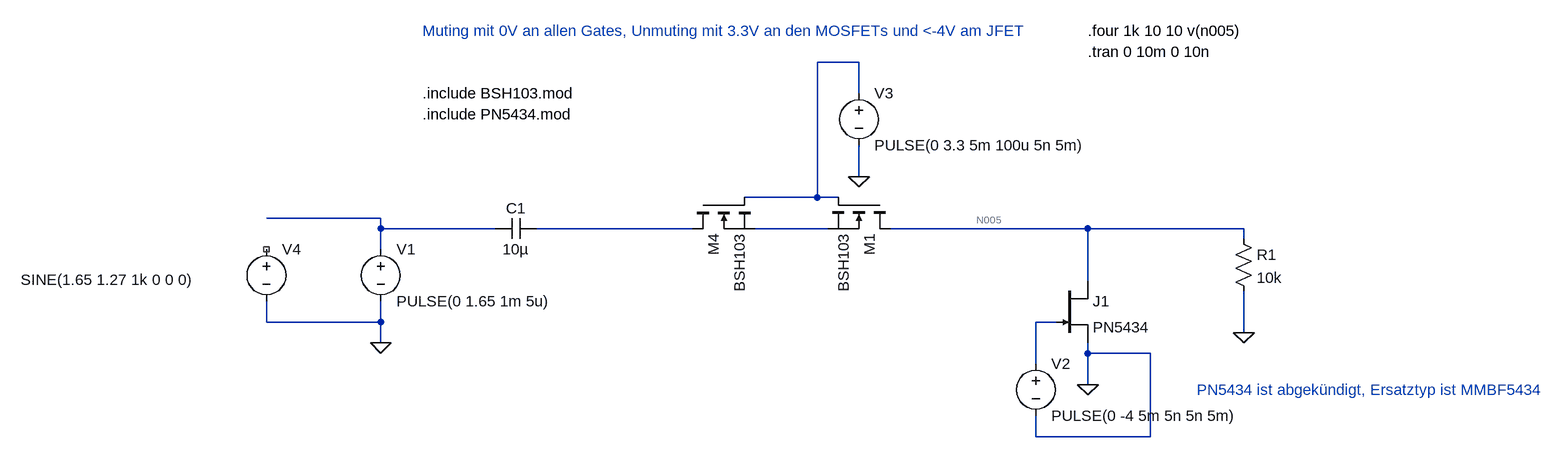
[diagram p0: schematic muting.asc]
muting.asc, the LTspice schematic file:
Version 4
SHEET 1 1444 680
WIRE 368 -96 304 -96
WIRE 368 -48 368 -96
WIRE 368 80 368 32
WIRE 304 112 304 -96
WIRE 304 112 192 112
WIRE 336 112 304 112
WIRE -368 144 -544 144
WIRE -368 160 -368 144
WIRE -192 160 -368 160
WIRE 112 160 -128 160
WIRE 320 160 208 160
WIRE 720 160 416 160
WIRE 960 160 720 160
WIRE 960 176 960 160
WIRE -368 192 -368 160
WIRE 720 240 720 160
WIRE -544 304 -544 272
WIRE -368 304 -368 272
WIRE -368 304 -544 304
WIRE 672 304 640 304
WIRE 960 320 960 256
WIRE -368 336 -368 304
WIRE 720 352 720 336
WIRE 816 352 720 352
WIRE 640 368 640 304
WIRE 720 400 720 352
WIRE 640 480 640 448
WIRE 816 480 816 352
WIRE 816 480 640 480
FLAG -368 336 0
FLAG 720 400 0
FLAG 368 80 0
FLAG 960 320 0
SYMBOL voltage -368 176 R0
WINDOW 123 0 0 Left 2
WINDOW 39 0 0 Left 2
SYMATTR InstName V1
SYMATTR Value PULSE(0 1.65 1m 5u)
SYMBOL njf 672 240 R0
SYMATTR InstName J1
SYMATTR Value PN5434
SYMBOL voltage 640 352 R0
WINDOW 123 0 0 Left 2
WINDOW 39 0 0 Left 2
SYMATTR InstName V2
SYMATTR Value PULSE(0 -4 5m 5n 5n 5m)
SYMBOL nmos 416 112 R90
SYMATTR InstName M1
SYMATTR Value BSH103
SYMATTR Prefix X
SYMBOL voltage 368 -64 R0
WINDOW 123 0 0 Left 2
WINDOW 39 0 0 Left 2
SYMATTR InstName V3
SYMATTR Value PULSE(0 3.3 5m 100u 5n 5m)
SYMBOL nmos 112 112 M90
SYMATTR InstName M4
SYMATTR Value BSH103
SYMATTR Prefix X
SYMBOL res 944 160 R0
SYMATTR InstName R1
SYMATTR Value 10k
SYMBOL voltage -544 176 R0
WINDOW 123 0 0 Left 2
WINDOW 39 0 0 Left 2
WINDOW 3 -378 63 Left 2
SYMATTR Value SINE(1.65 1.27 1k 0 0 0)
SYMATTR InstName V4
SYMBOL cap -128 144 R90
WINDOW 0 0 32 VBottom 2
WINDOW 3 32 32 VTop 2
SYMATTR InstName C1
SYMATTR Value 10µ
TEXT 720 -112 Left 2 !.tran 0 10m 0 10n
TEXT -304 -48 Left 2 !.include BSH103.mod
TEXT 720 -144 Left 2 !.four 1k 10 10 v(n005)
TEXT -304 -144 Left 2 ;Muting mit 0V an allen Gates, Unmuting mit 3.3V an den MOSFETs und <-4V am JFET
TEXT -304 -16 Left 2 !.include PN5434.mod
TEXT 888 408 Left 2 ;PN5434 ist abgekündigt, Ersatztyp ist MMBF5434

The netlist it stands for:
* muting.asc
V1 N002 0 PULSE(0 1.65 1m 5u)
J1 N005 N006 0 PN5434
V2 N006 0 PULSE(0 -4 5m 5n 5n 5m)
XM1 N005 N001 N004 BSH103  ; pins D G S
V3 N001 0 PULSE(0 3.3 5m 100u 5n 5m)
XM4 N003 N001 N004 BSH103  ; pins D G S
R1 N005 0 10k
V4 NC_01 0 SINE(1.65 1.27 1k 0 0 0)
C1 N003 N002 10µ
.model NJF NJF
.model PJF PJF
.lib standard.jft
.tran 0 10m 0 10n
.include BSH103.mod
.four 1k 10 10 v(n005)
* Muting mit 0V an allen Gates, Unmuting mit 3.3V an den MOSFETs und <-4V am JFET
.include PN5434.mod
* PN5434 ist abgekündigt, Ersatztyp ist MMBF5434
.backanno
.end